# Altium schematic sheet AMX_audio30.SchDoc
size A
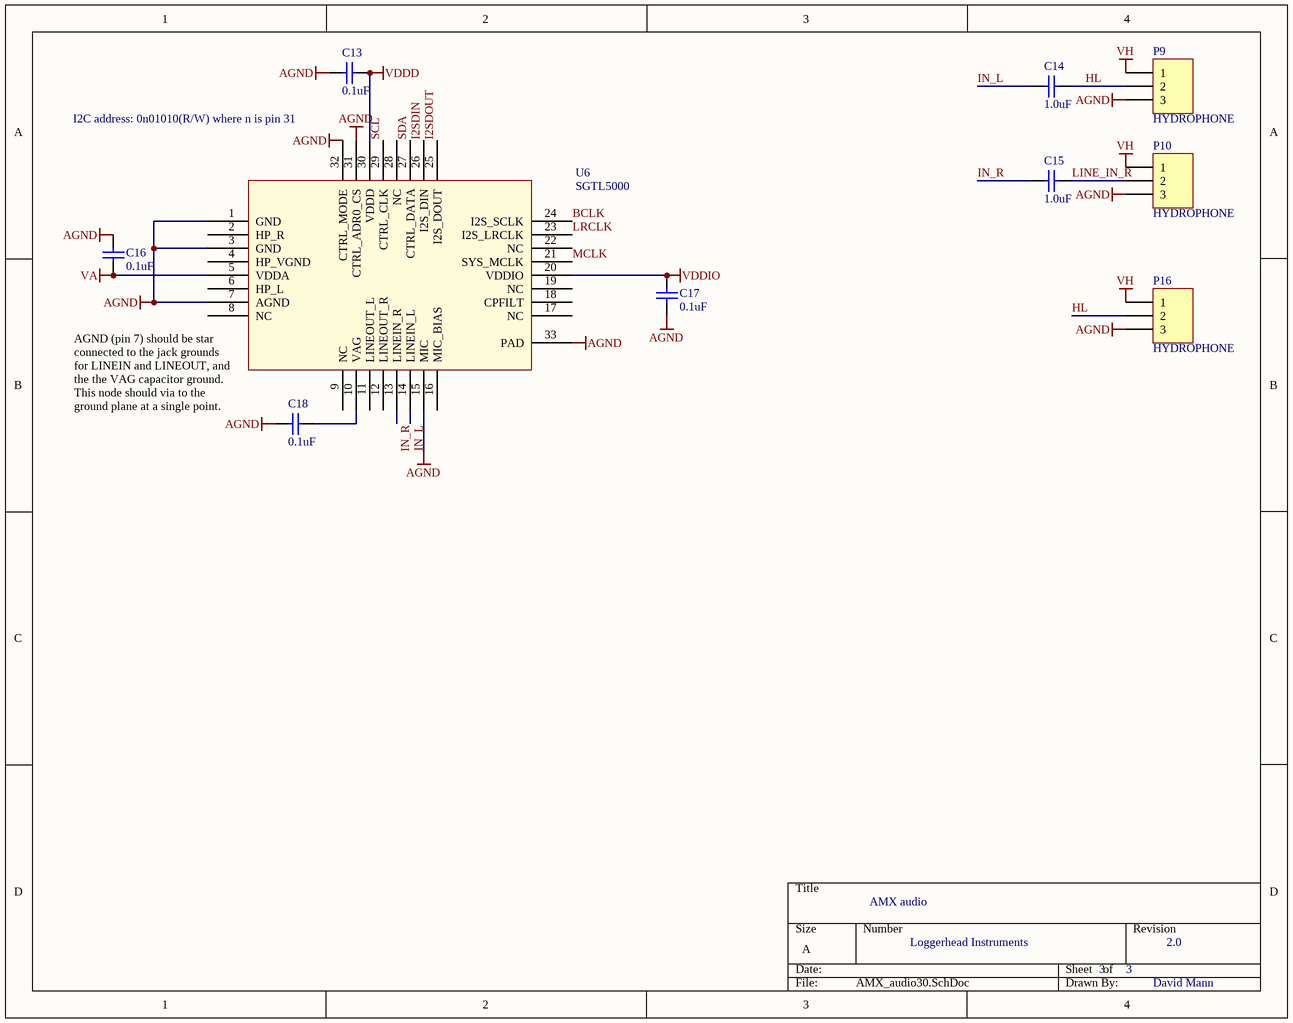
[diagram p0: AMX_audio30.SchDoc]

## Parts
C13  0.1uF  [0402]
C14  1.0uF  [0402]
C15  1.0uF  [0402]
C16  0.1uF  [0402]
C17  0.1uF  [0402]
C18  0.1uF  [0402]
P9  HYDROPHONE  [HDR1X3]
P10  HYDROPHONE  [HDR1X3]
P16  HYDROPHONE  [HDR1X3]
U6  SGTL5000  [QFN32]

## Nets
AGND: C13.2 C16.2 C17.2 C18.2 P9.3 P10.3 P16.3 U6.1(GND) U6.3(GND) U6.7(AGND) U6.15(MIC) U6.31(CTRL_ADR0_CS) U6.32(CTRL_MODE) U6.33(PAD)
VA: C16.1 U6.5(VDDA)
VDDD: C13.1 U6.30(VDDD)
VDDIO: C17.1 U6.20(VDDIO)
VH: P9.1 P10.1 P16.1
BCLK: U6.24(I2S_SCLK)
HL: C14.1 P9.2 P16.2
I2SDIN: U6.26(I2S_DIN)
I2SDOUT: U6.25(I2S_DOUT)
IN_L: C14.2 U6.14(LINEIN_L)
IN_R: C15.2 U6.13(LINEIN_R)
LINE_IN_R: C15.1 P10.2
LRCLK: U6.23(I2S_LRCLK)
MCLK: U6.21(SYS_MCLK)
SCL: U6.29(CTRL_CLK)
SDA: U6.27(CTRL_DATA)
NetC18_1: C18.1 U6.10(VAG)

Not connected (* = marked no-connect by the designer): U6 2(HP_R) 4(HP_VGND) 6(HP_L) 8(NC) 9(NC) 11(LINEOUT_L) 12(LINEOUT_R) 16(MIC_BIAS) 17(NC) 18(CPFILT) 19(NC) 22(NC) 28(NC)

## Notes on the sheet
- I2C address: 0n01010(R/W) where n is pin 31
- (near U6) AGND (pin 7) should be star connected to the jack grounds for LINEIN and LINEOUT, and the the VAG capacitor ground. This node should via to the ground plane at a single point.
- AMX audio
- Loggerhead Instruments
- 3
- 2.0
- David Mann

## Library data of the parts
C13 C16-C18 = C0402: Ceramic Chip Capacitor - Standard; Note: Footprint corresponds to dimensions for bulk cassette packaging. This case size has tightened tolerances.; Published: 17-Jul-2002; LatestRevisionDate: 19-Mar-2004; LatestRevisionNote: Silkscreen size reduced.; DatasheetDocument: Mar-2001; PackageDocument: Mar-2001; PackageReference: 0402; Publisher: Altium Limited; Code_JEITA: 0402; Code_IPC: 1005 [0402]; ComponentLink1Description: Manufacturer Link; ComponentLink1URL: http://www.kemet.com/; ComponentLink2Description: Datasheet; ComponentLink2URL: http://www.kemet.com/kemet/web/homepage/kechome.nsf/vapubfilesname/F3102TA.pdf/$file/F3102TA.pdf; Value: 0.1uF
C14 C15 = C0402: Ceramic Chip Capacitor - Standard; Note: Footprint corresponds to dimensions for bulk cassette packaging. This case size has tightened tolerances.; Value: 0.1uF; Published: 17-Jul-2002; LatestRevisionDate: 19-Mar-2004; LatestRevisionNote: Silkscreen size reduced.; DatasheetDocument: Mar-2001; PackageDocument: Mar-2001; PackageReference: 0402; Publisher: Altium Limited; Code_JEITA: 0402; Code_IPC: 1005 [0402]; ComponentLink1Description: Manufacturer Link; ComponentLink1URL: http://www.kemet.com/; ComponentLink2Description: Datasheet; ComponentLink2URL: http://www.kemet.com/kemet/web/homepage/kechome.nsf/vapubfilesname/F3102TA.pdf/$file/F3102TA.pdf
P9 P10 P16 = Header 3: Header, 3-Pin; LatestRevisionDate: 17-Jul-2002; LatestRevisionNote: Re-released for DXP Platform.; Publisher: Altium Limited